# Altium schematic sheet SmartSwitch.SchDoc
size A4; SheetNumber: 1; SheetTotal: 1
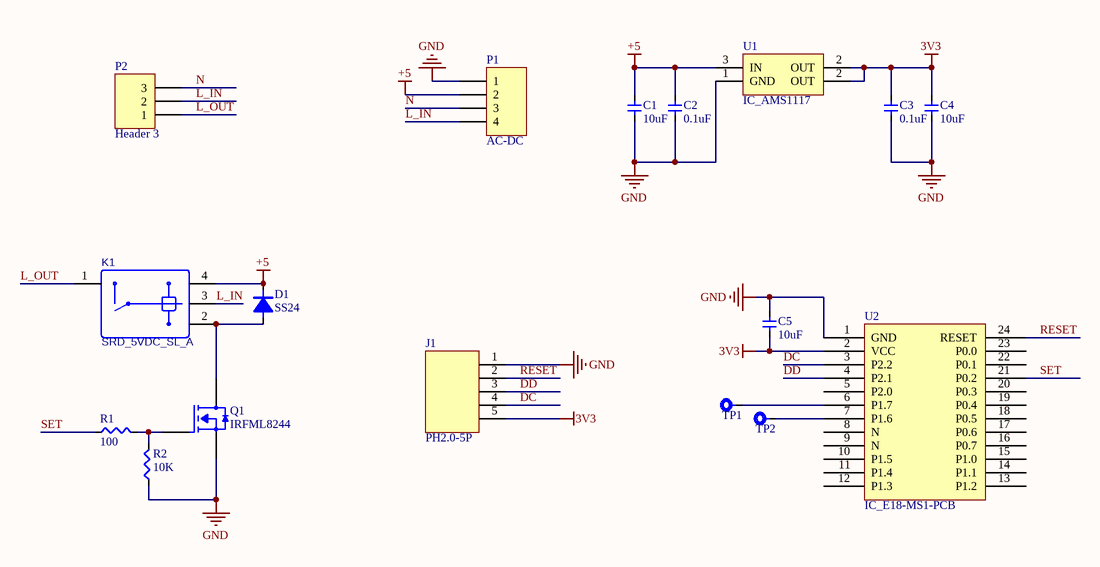
[diagram p0: SmartSwitch.SchDoc]

## Parts
C1  10uF  [C 0603_M]
C2  0.1uF  [C 0603_M]
C3  0.1uF  [C 0603_M]
C4  10uF  [C 0603_M]
C5  10uF  [C 0603_M]
D1  SS24  [D SMA/DO-214AC]
J1  PH2.0-5P  [PH2.0-LI-5P]
K1  SRD_5VDC_SL_A  [K_SRD_XXVDC-XX-A]
P1  AC-DC  [AC_DC]
P2  Header 3  [P5.08_3P]
Q1  IRFML8244  [SOT23-3M]
R1  100  [R 0603_M]
R2  10K  [R 0603_M]
TP1  TP  [TP_BIG]  (value not drawn)
TP2  TP  [TP_BIG]  (value not drawn)
U1  IC_AMS1117  [SOT89]
U2  IC_E18-MS1-PCB  [E18_MS1_PCB]

## Nets
3V3: C3.1 C4.1 C5.2 J1.5 U1.2(OUT) U2.2(VCC)
+5: C1.1 C2.1 D1.K K1.4 P1.2 U1.3(IN)
GND: C1.2 C2.2 C3.2 C4.2 C5.1 J1.1 P1.1 Q1.2(S) R2.1 U1.1(GND) U2.1(GND)
DC: J1.4 U2.3(P2.2)
DD: J1.3 U2.4(P2.1)
L_IN: K1.3 P1.4 P2.2
L_OUT: K1.1 P2.1
N: P1.3 P2.3
RESET: J1.2 U2.24(RESET)
SET: R1.1 U2.21(P0.2)
NetD1_A: D1.A K1.2 Q1.3(D)
NetQ1_1: Q1.1(G) R1.2 R2.2
NetTP1_1: TP1.1 U2.6(P1.7)
NetTP2_1: TP2.1 U2.7(P1.6)

Not connected (* = marked no-connect by the designer): U2 5(P2.0) 8(N) 9(N) 10(P1.5) 11(P1.4) 12(P1.3) 13(P1.2) 14(P1.1) 15(P1.0) 16(P0.7) 17(P0.6) 18(P0.5) 19(P0.4) 20(P0.3) 22(P0.1) 23(P0.0)

## Library data of the parts
C1-C5 = CAP: 电容
D1 = DIODE: 普通二极管
K1 = K_SRD_5VDC_SL_A: 一组常开; BOM_Manufacturer: Ningbo Songle Relay; BOM_Manufacturer Part: SRD-5VDC-SL-A; Contributor: LCSC; BOM_Supplier: LCSC; BOM_Supplier Part: C140615; BOM_JLCPCB Part Class: Extended Part; spicePre: K; spiceSymbolName: SRD-5VDC-SL-A
P1 = Header 4: Header, 4-Pin; LatestRevisionDate: 17-Jul-2002; LatestRevisionNote: Re-released for DXP Platform.; Publisher: Altium Limited
P2 = Header 3: Header, 3-Pin; LatestRevisionDate: 17-Jul-2002; LatestRevisionNote: Re-released for DXP Platform.; Publisher: Altium Limited
Q1 = TX_MOS-N: NMOS
R1 R2 = RES: 电阻
TP1 TP2 = TP: 测试点或焊盘
U1 = U_LDO_AMS1117: 线性稳压器
U2 = IC_E18-MS1-PCB: Zigbee模块